# Altium schematic sheet USBINFRTransiever_MCU.SchDoc
size 420 x 297 mm; DocumentNumber: ФНКЦ.542321.001 Э3; SheetNumber: 3; Format: A3
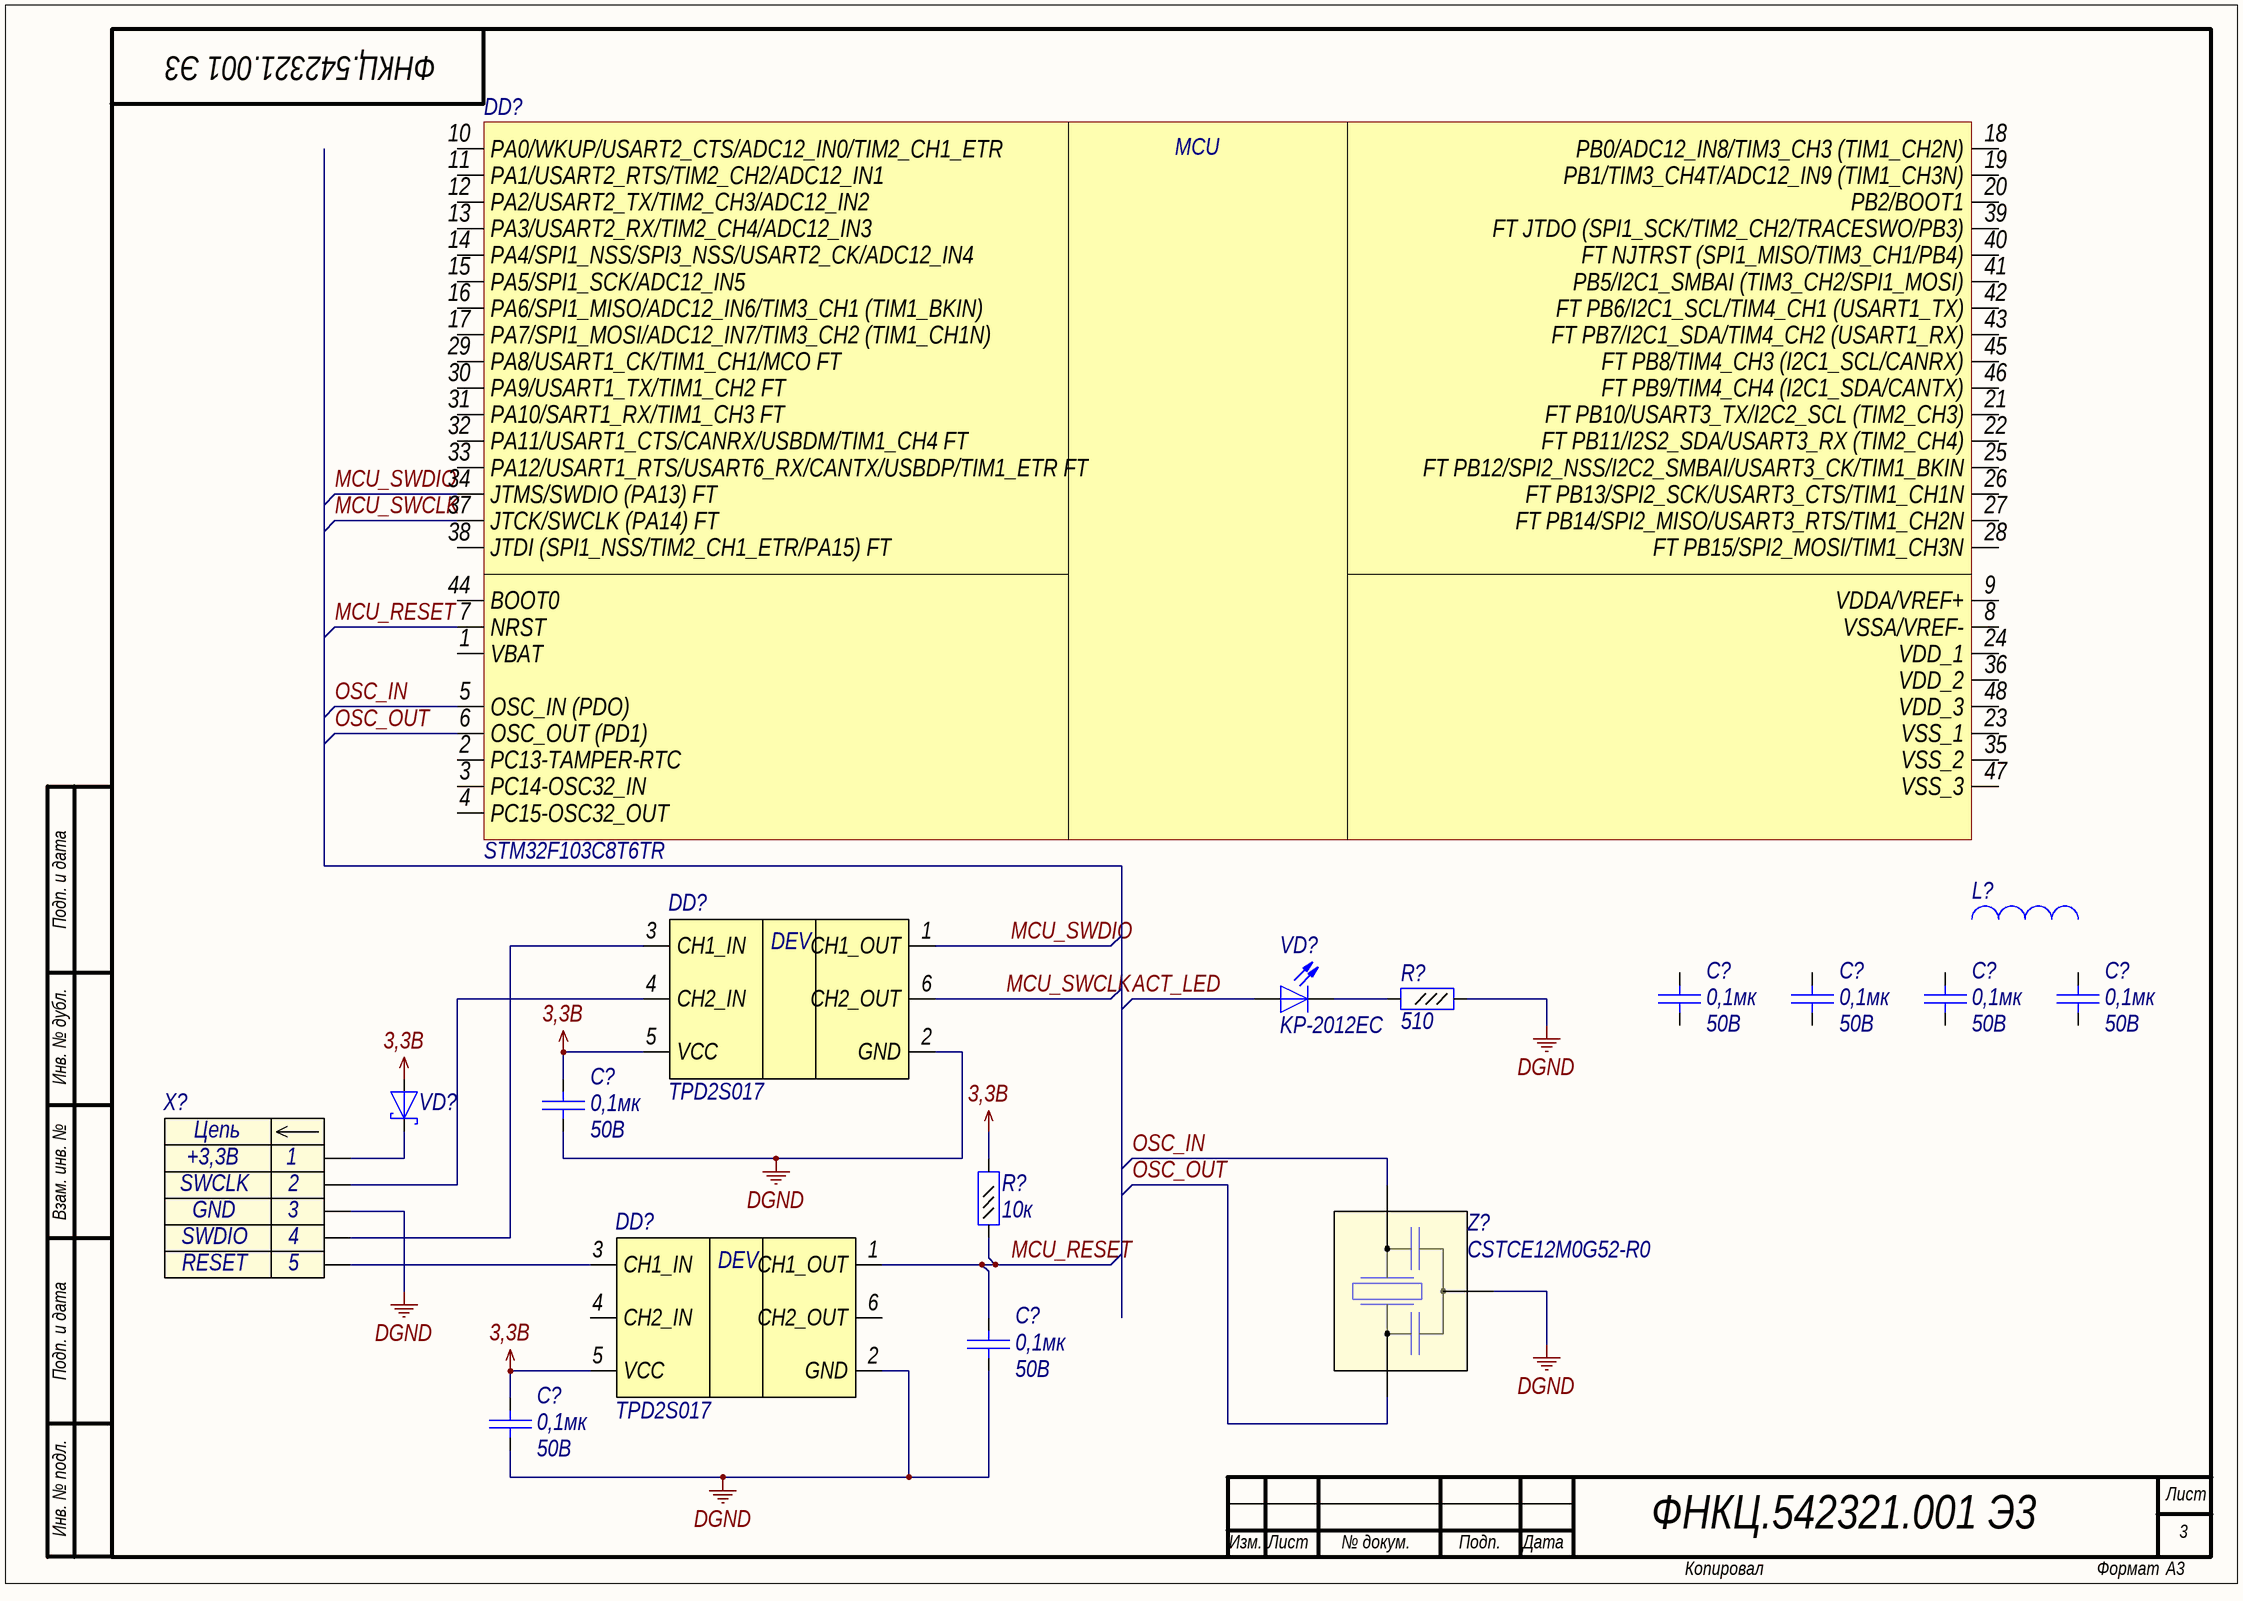
[diagram p0: USBINFRTransiever_MCU.SchDoc]

## Parts
(Parts that share a designator on the sheet are numbered #1, #2 ... from top to bottom, then left to right.)
C?#1  value 0,1мк  Voltage: 50B  [C0603]  (hidden comment: Capacitor)
C?#2  value 0,1мк  Voltage: 50B  [C0603]  (hidden comment: Capacitor)
C?#3  value 0,1мк  Voltage: 50B  [C0603]  (hidden comment: Capacitor)
C?#4  value 0,1мк  Voltage: 50B  [C0603]  (hidden comment: Capacitor)
C?#5  value 0,1мк  Voltage: 50B  [C0603]  (hidden comment: Capacitor)
C?#6  value 0,1мк  Voltage: 50B  [C0603]  (hidden comment: Capacitor)
C?#7  value 0,1мк  Voltage: 50B  [C0603]  (hidden comment: Capacitor)
DD?#1  STM32F103C8T6TR  [LQFP48]
DD?#2  TPD2S017  [SOT23-6]
DD?#3  TPD2S017  [SOT23-6]
L?  Inductor  [L0603]  (value not drawn)
R?#1  value 510  [R0603]  (hidden comment: Resistor_0,062Вт)
R?#2  value 10к  [R0603]  (hidden comment: Resistor_0,062Вт)
VD?#1  Part Number: KP-2012EC  [L_0805]  (hidden comment: LED)
VD?#2  DiodeSchottky  [SOD-523]  (value not drawn)
X?  Header_5_plg  [PLS-5]  (value not drawn)
Z?  Part Number: CSTCE12M0G52-R0  [CSTCE]  (hidden comment: QuartzWithCaps)

## Nets
3,3B: C?#5.2 C?#7.2 DD?#2.5(VCC) DD?#3.5(VCC) R?#2.2 VD?#2.2(A)
DGND: C?#5.1 C?#6.1 C?#7.1 DD?#2.2(GND) DD?#3.2(GND) R?#1.1 X?.3 Z?.2
ACT_LED: VD?#1.2(A)
MCU_RESET: C?#6.2 DD?#1.7(NRST) DD?#3.1(CH1_OUT) R?#2.1
MCU_SWCLK: DD?#1.37(JTCK/SWCLK_(PA14)_FT) DD?#2.6(CH2_OUT)
MCU_SWDIO: DD?#1.34(JTMS/SWDIO_(PA13)_FT) DD?#2.1(CH1_OUT)
OSC_IN: DD?#1.5(OSC_IN_(PDO)) Z?.3
OSC_OUT: DD?#1.6(OSC_OUT_(PD1)) Z?.1
NetDD?#2_3: DD?#2.3(CH1_IN) X?.4
NetDD?#2_4: DD?#2.4(CH2_IN) X?.2
NetDD?#3_3: DD?#3.3(CH1_IN) X?.5
NetR?#1_2: R?#1.2 VD?#1.1(K)
NetVD?#2_1: VD?#2.1(K) X?.1

Not connected (* = marked no-connect by the designer): C?#1 1 2; C?#2 1 2; C?#3 1 2; C?#4 1 2; DD?#1 1(VBAT) 2(PC13-TAMPER-RTC) 3(PC14-OSC32_IN) 4(PC15-OSC32_OUT) 8(VSSA/VREF-) 9(VDDA/VREF+) 10(PA0/WKUP/USART2_CTS/ADC12_IN0/TIM2_CH1_ETR) 11(PA1/USART2_RTS/TIM2_CH2/ADC12_IN1) 12(PA2/USART2_TX/TIM2_CH3/ADC12_IN2) 13(PA3/USART2_RX/TIM2_CH4/ADC12_IN3) 14(PA4/SPI1_NSS/SPI3_NSS/USART2_CK/ADC12_IN4) 15(PA5/SPI1_SCK/ADC12_IN5) 16(PA6/SPI1_MISO/ADC12_IN6/TIM3_CH1_(TIM1_BKIN)) 17(PA7/SPI1_MOSI/ADC12_IN7/TIM3_CH2_(TIM1_CH1N)) 18(PB0/ADC12_IN8/TIM3_CH3_(TIM1_CH2N)) 19(PB1/TIM3_CH4T/ADC12_IN9_(TIM1_CH3N)) 20(PB2/BOOT1) 21(FT_PB10/USART3_TX/I2C2_SCL_(TIM2_CH3)) 22(FT_PB11/I2S2_SDA/USART3_RX_(TIM2_CH4)) 23(VSS_1) 24(VDD_1) 25(FT_PB12/SPI2_NSS/I2C2_SMBAI/USART3_CK/TIM1_BKIN) 26(FT_PB13/SPI2_SCK/USART3_CTS/TIM1_CH1N) 27(FT_PB14/SPI2_MISO/USART3_RTS/TIM1_CH2N) 28(FT_PB15/SPI2_MOSI/TIM1_CH3N) 29(PA8/USART1_CK/TIM1_CH1/MCO_FT) 30(PA9/USART1_TX/TIM1_CH2_FT) 31(PA10/SART1_RX/TIM1_CH3_FT) 32(PA11/USART1_CTS/CANRX/USBDM/TIM1_CH4_FT) 33(PA12/USART1_RTS/USART6_RX/CANTX/USBDP/TIM1_ETR_FT) 35(VSS_2) 36(VDD_2) 38(JTDI_(SPI1_NSS/TIM2_CH1_ETR/PA15)_FT) 39(FT_JTDO_(SPI1_SCK/TIM2_CH2/TRACESWO/PB3)) 40(FT_NJTRST_(SPI1_MISO/TIM3_CH1/PB4)) 41(PB5/I2C1_SMBAI_(TIM3_CH2/SPI1_MOSI)) 42(FT_PB6/I2C1_SCL/TIM4_CH1_(USART1_TX)) 43(FT_PB7/I2C1_SDA/TIM4_CH2_(USART1_RX)) 44(BOOT0) 45(FT_PB8/TIM4_CH3_(I2C1_SCL/CANRX)) 46(FT_PB9/TIM4_CH4_(I2C1_SDA/CANTX)) 47(VSS_3) 48(VDD_3); DD?#3 4(CH2_IN) 6(CH2_OUT); L? 1 2

## Notes on the sheet
- Подп. и дата
- Инв. № дубл.
- Взам. инв. №
- Инв. № подл.
- Лист
- Изм.
- № докум.
- Подп.
- Дата
- Копировал
- Формат
- (in symbol connect6) Цепь
- (in symbol diode20) DEV
- (in symbol microcont0) MСU

## Library data of the parts
C?#1-C?#7 = cap131: Конденсатор; Part Name: Ceramic; Manufacture: Murata; Part Number: GRM188R71H104K; id: cap131; TKE: X7R
DD?#1 = microcont0: Medium-density performance line ARM®-based 32-bit MCU with 64  or 128 KB Flash, USB, CAN, 7 timers, 2 ADCs, 9 com. interfaces; Part Name: Microcontroller; Frequency: 72MHz; ADC: 10x12b; Interface: can, i2c, irda, lin, spi, uart, usb; Flash: 64kb; Pin in: 37; Power Supply: 2.0-3.6 V; id: microcont0; Part Number: STM32F103C8T6TR
DD?#2 DD?#3 = diode20: EMI Filter; Part Name: ESD Suppressors; Part Number: TPD2S017DBVR; Manufacture: Texas Instruments; Max Reverse Voltage: 12B; Capacitance: 1pF; Number of Channels: 2; id: diode20
L? = ind0: EMI Suppression Filter; Part Name: EMI Suppression Filters; Part Number: BLM18PG181SN1D; Rated Current: 1,5A; id: ind0; Resistance: 0,09Ohm
R?#1 = res452: Резистор; Manufacture: Yageo; Part Number: RC0603FR-07510RL; id: res452; Accuracy: 1%; Part Name: Resistor; Power: 0,062Вт
R?#2 = res483: Резистор; Manufacture: Yageo; Part Number: RC0603FR-0710KL; id: res483; Accuracy: 1%; Part Name: Resistor; Power: 0,062Вт
VD?#1 = diode8: Светодиод; id: diode8; Part Name: LED
VD?#2 = diode21: Диод Шоттки; Part Number: PMEG2010AEB.115; Manufacture: NXP Semiconductor; Max Reverse Voltage: 20B; Forward Voltage: 0,62B; Forward Current: 1А; Breakdown Current: 600uA; Capacitance: 25pF; Number of Channels: 1; id: diode21; Part Name: Diode Schottky
X? = connect6: Разъем - 5 конт. вилка; Part Number: DS1021-1*5SF112-B; Manufacture: Ningbo connfly electronic; Contact_1: +3,3B; Contact_2: SWCLK; Contact_3: GND; Contact_4: SWDIO; Contact_5: RESET; Etch: 2,54mm; Part Name: PLS-5; id: connect6
Z? = crystal5: Кварцевый резорнатор со встроенными нагрузочными конденсаторами; Manufacture: Murata; Frequence: 12MHz; id: crystal5